# EAGLE design BpodMainBoard_r1_0 (EAGLE 8.4.3)
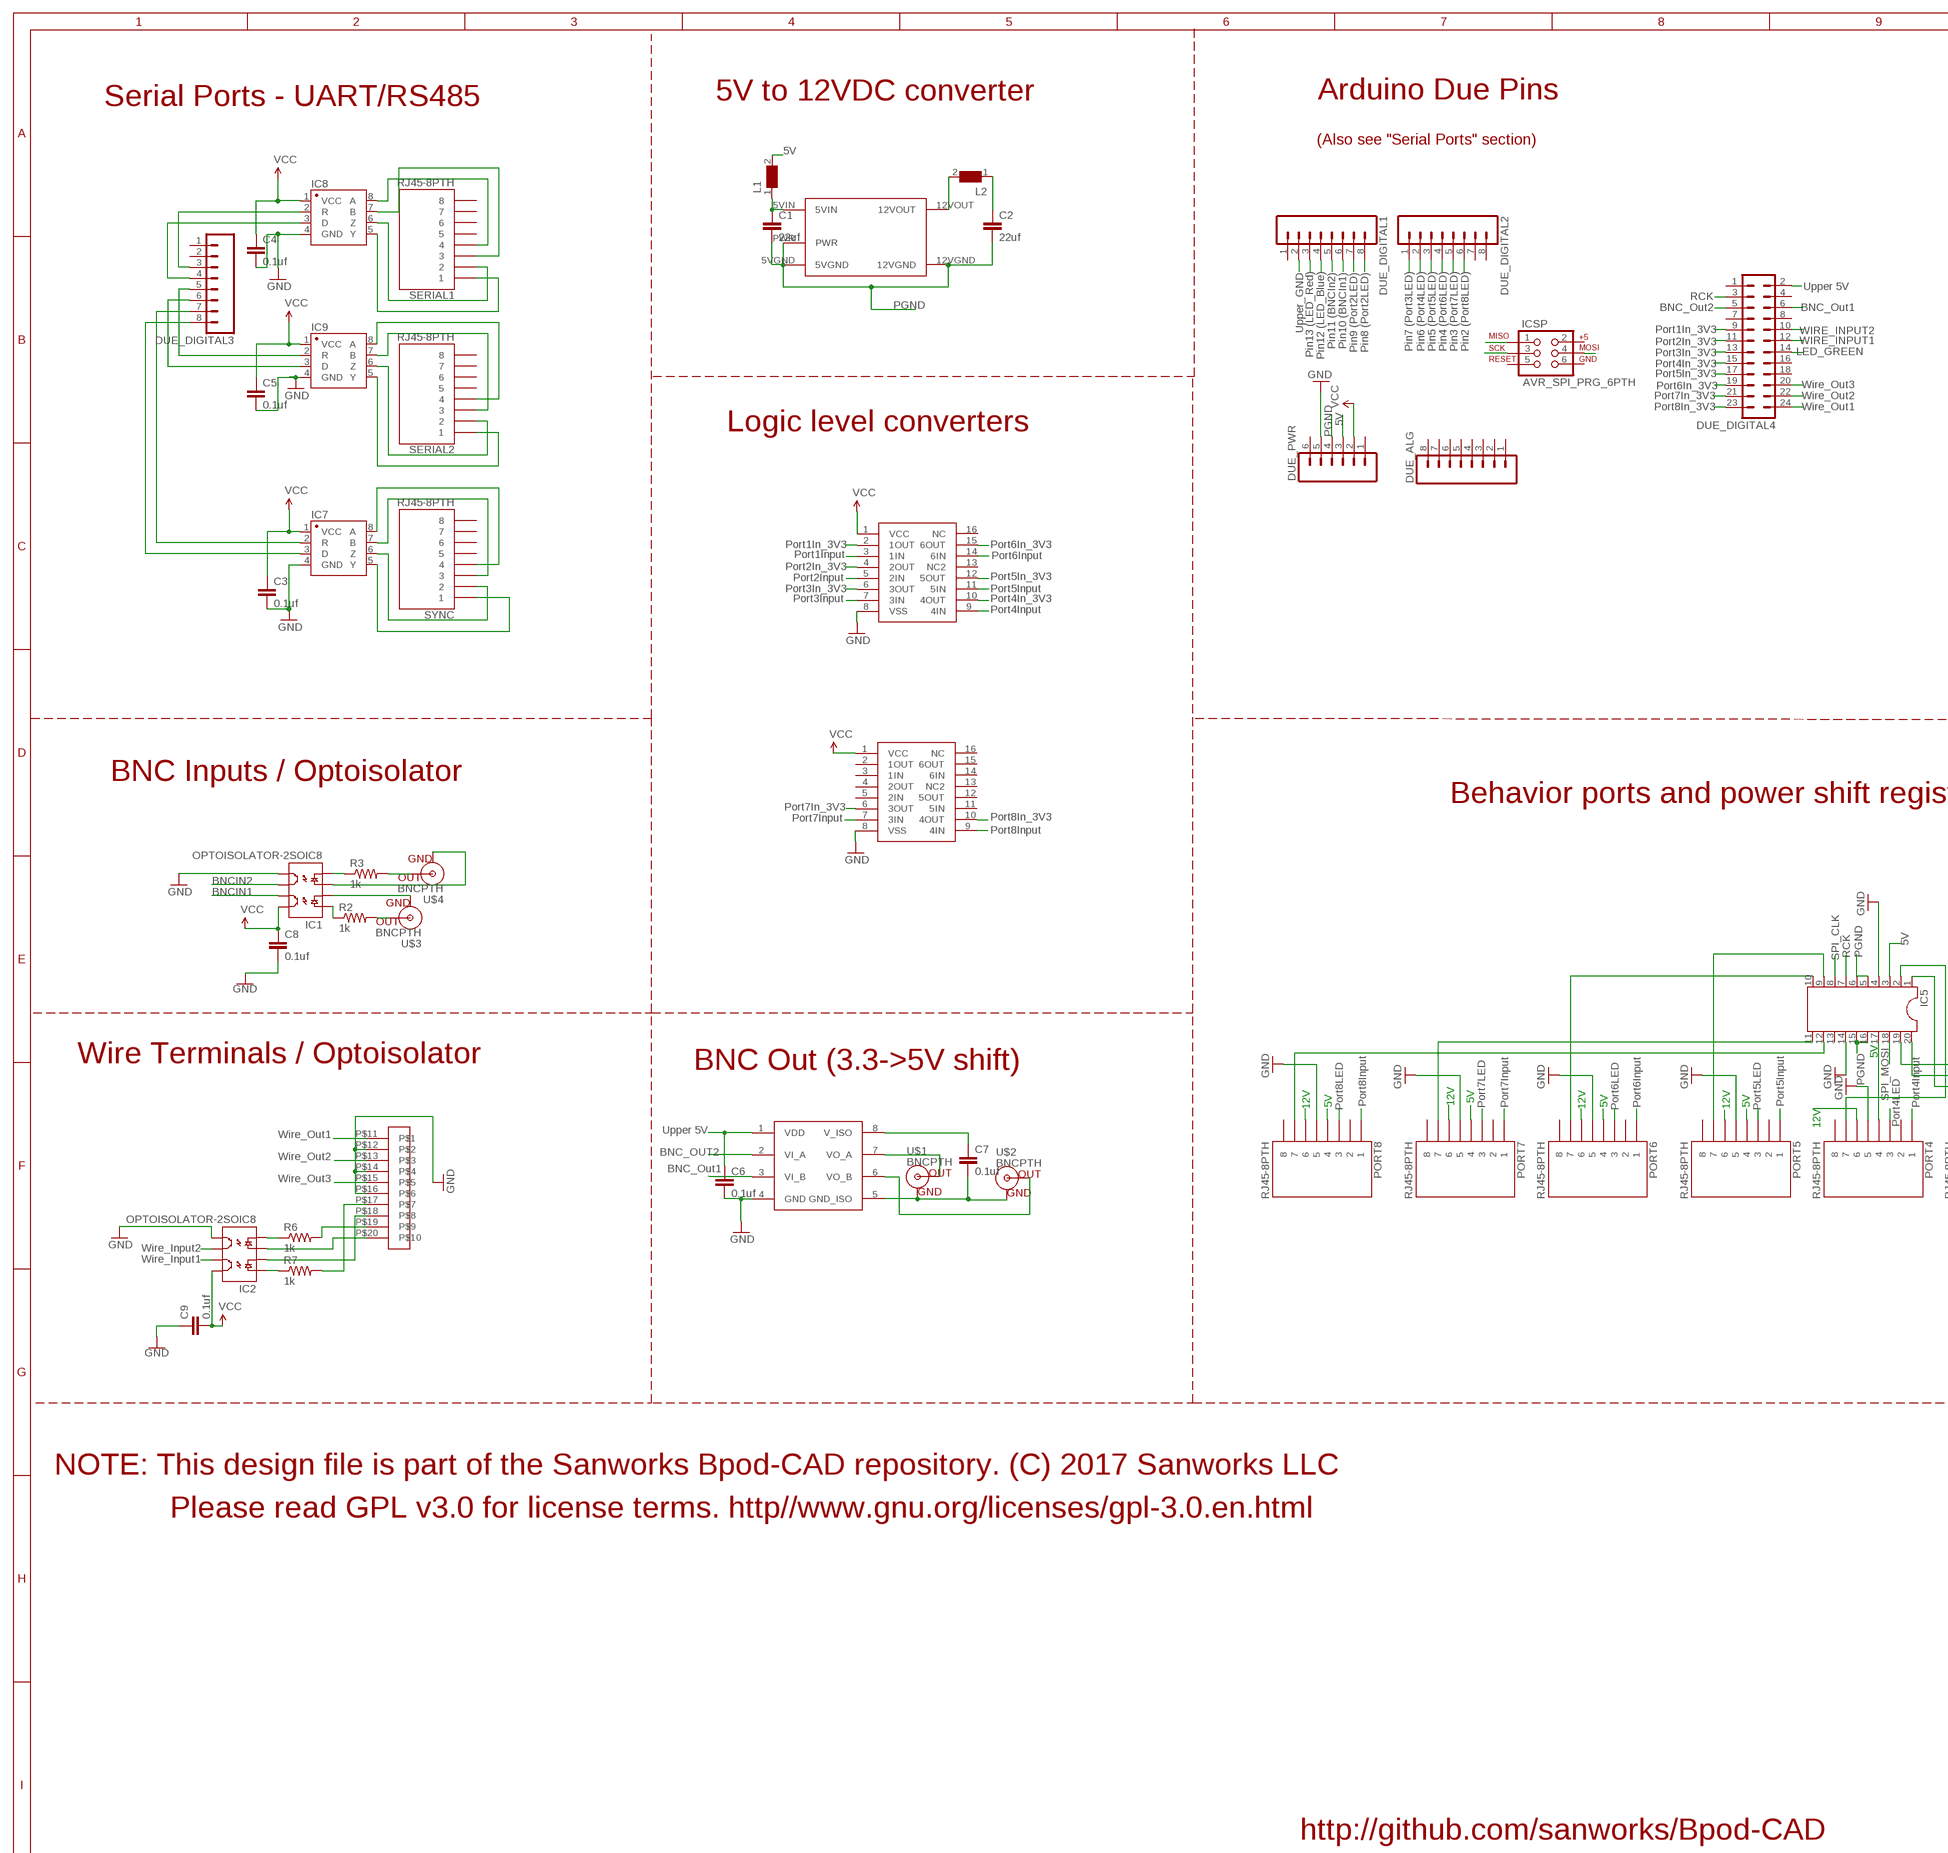
[diagram p0: schematic, sheet 1, part 1 of 2]
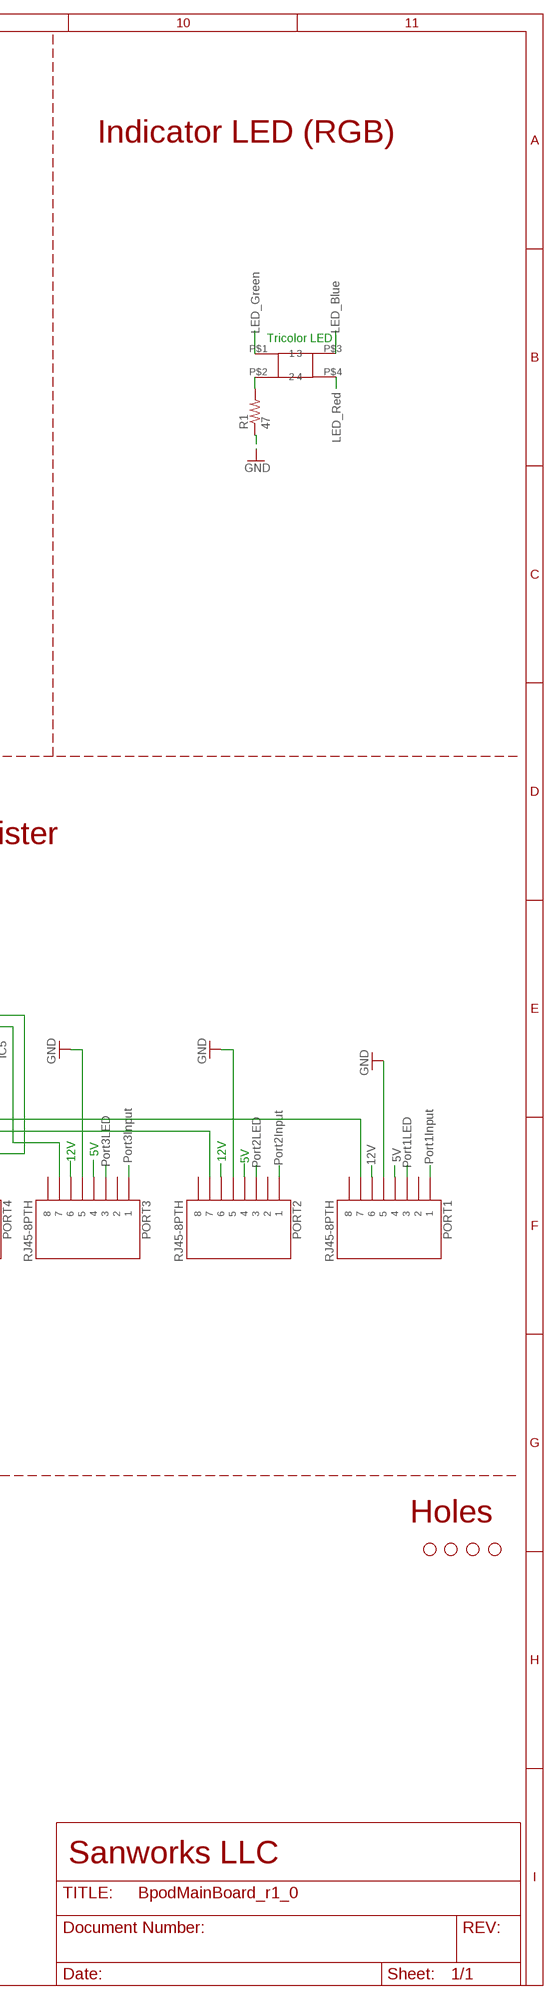
[diagram p1: schematic, sheet 1, part 2 of 2]

## Parts
C1  22uf  CAP1206  [1206]
C2  22uf  CAP1206  [1206]
C3  0.1uf  CAP1206  [1206]
C4  0.1uf  CAP1206  [1206]
C5  0.1uf  CAP1206  [1206]
C6  0.1uf  CAP1206  [1206]
C7  0.1uf  CAP1206  [1206]
C8  0.1uf  CAP1206  [1206]
C9  0.1uf  CAP1206  [1206]
DUE_ALG  M081X08  [1X08]
DUE_DIGITAL1  M081X08  [1X08]
DUE_DIGITAL2  M081X08  [1X08]
DUE_DIGITAL3  M081X08  [1X08]
DUE_DIGITAL4  MA12-2  [MA12-2]
DUE_PWR  M06SIP  [1X06]
IC1  OPTOISOLATOR-2SOIC8  [SO08-2]
IC2  OPTOISOLATOR-2SOIC8  [SO08-2]
IC3  CD4050  [SO16]
IC4  CD4050  [SO16]
IC5  DIL20  [DIL20]
IC7  SN65HVD31DR  [SO08]
IC8  SN65HVD31DR  [SO08]
IC9  SN65HVD31DR  [SO08]
IC10  ADUM5240  [SO08]
ICSP  AVR_SPI_PRG_6PTH  [2X3]
JP1  STAND-OFF  [STAND-OFF]
JP2  STAND-OFF  [STAND-OFF]
JP3  STAND-OFF  [STAND-OFF]
JP4  STAND-OFF  [STAND-OFF]
L1  WE-CBF-742792118_1206  [1206]
L2  WE-CBF-742792118_1206  [1206]
PORT1  RJ45-8PTH  [RJ45-8]
PORT2  RJ45-8PTH  [RJ45-8]
PORT3  RJ45-8PTH  [RJ45-8]
PORT4  RJ45-8PTH  [RJ45-8]
PORT5  RJ45-8PTH  [RJ45-8]
PORT6  RJ45-8PTH  [RJ45-8]
PORT7  RJ45-8PTH  [RJ45-8]
PORT8  RJ45-8PTH  [RJ45-8]
R1  47  RESISTOR1206  [1206]
R2  1k  RESISTOR1206  [1206]
R3  1k  RESISTOR1206  [1206]
R6  1k  RESISTOR1206  [1206]
R7  1k  RESISTOR1206  [1206]
SERIAL1  RJ45-8PTH  [RJ45-8]
SERIAL2  RJ45-8PTH  [RJ45-8]
SYNC  RJ45-8PTH  [RJ45-8]
U$1  BNCPTH  [BNC]
U$2  BNCPTH  [BNC]
U$3  BNCPTH  [BNC]
U$4  BNCPTH  [BNC]
U$5  TDK_LAMBDA_5V_TO_12V  [TDK_LAMBDA_5V_12V]
U$6  10POS_SPRING_TERMINAL  [10POS_SCREW_TERMINAL]
U$8  SQUARE_TRICOLOR_LED  [SQUARE_TRICOLOR_LED]

## Nets
5V: DUE_PWR.3 IC5.3 IC5.17 L1.2 PORT1.4 PORT2.4 PORT3.4 PORT4.4 PORT5.4 PORT6.4 PORT7.4 PORT8.4
12V: C2.1 L2.1 PORT1.6 PORT2.6 PORT3.6 PORT4.6 PORT5.6 PORT6.6 PORT7.6 PORT8.6
BNC_OUT1: DUE_DIGITAL4.6 IC10.3(VI_B)
BNC_OUT2: DUE_DIGITAL4.5 IC10.2(VI_A)
BNCIN1: DUE_DIGITAL1.6 IC1.7(EM1)
BNCIN2: DUE_DIGITAL1.5 IC1.6(CL2)
GND: C3.2 C4.2 C5.2 C6.2 C8.2 C9.1 DUE_PWR.5 IC1.5(EM2) IC2.5(EM2) IC3.8(VSS) IC4.8(VSS) IC5.4 IC5.14 IC7.4(GND) IC8.4(GND) IC9.4(GND) IC10.4(GND) PORT1.5 PORT2.5 PORT3.5 PORT4.5 PORT5.5 PORT6.5 PORT7.5 PORT8.5 R1.1 U$6.P$12 U$6.P$14 U$6.P$16
ISOGND: C7.2 IC10.5(GND_ISO) U$1.GND U$2.GND
LED_BLUE: DUE_DIGITAL1.4 U$8.P$3
LED_GREEN: DUE_DIGITAL4.14 U$8.P$1
LED_RED: DUE_DIGITAL1.3 U$8.P$4
MOSI: IC5.18 ICSP.4
N$1: R3.2 U$4.S(OUT)
N$2: R2.2 U$3.S(OUT)
N$3: IC1.3(A2) U$4.GND
N$4: IC1.2(C1) U$3.GND
N$5: R6.2 U$6.P$19
N$6: IC10.6(VO_B) U$2.S(OUT)
N$8: IC10.7(VO_A) U$1.S(OUT)
N$9: IC5.19 PORT1.7
N$10: IC5.20 PORT2.7
N$11: IC5.1 PORT3.7
N$12: IC5.2 PORT4.7
N$13: IC5.9 PORT5.7
N$14: IC5.10 PORT6.7
N$15: IC5.11 PORT7.7
N$16: IC5.12 PORT8.7
N$17: IC7.8(A) SYNC.4
N$18: IC7.7(B) SYNC.3
N$19: IC7.6(Z) SYNC.2
N$21: IC7.5(Y) SYNC.1
N$22: DUE_DIGITAL3.7 IC7.2(R)
N$23: IC2.4(C2) R6.1
N$24: IC2.1(A1) R7.1
N$25: R1.2 U$8.P$2
N$26: C7.1 IC10.8(V_ISO)
N$28: DUE_DIGITAL3.8 IC7.3(D)
N$32: IC8.8(A) SERIAL1.4
N$33: IC8.7(B) SERIAL1.3
N$34: IC8.6(Z) SERIAL1.2
N$35: IC8.5(Y) SERIAL1.1
N$36: IC9.8(A) SERIAL2.4
N$37: IC9.7(B) SERIAL2.3
N$38: IC9.6(Z) SERIAL2.2
N$40: IC9.5(Y) SERIAL2.1
N$42: DUE_DIGITAL3.3 IC8.2(R)
N$43: IC2.3(A2) U$6.P$20
N$44: R7.2 U$6.P$17
N$45: IC2.2(C1) U$6.P$18
N$46: C1.1 L1.1 U$5.5VIN
N$47: L2.2 U$5.12VOUT
N$48: DUE_DIGITAL3.4 IC8.3(D)
N$52: DUE_DIGITAL3.5 IC9.2(R)
N$53: DUE_DIGITAL3.6 IC9.3(D)
N$54: IC1.1(A1) R2.1
N$55: IC1.4(C2) R3.1
PGND: C1.2 C2.2 DUE_PWR.4 IC5.5 IC5.6 IC5.15 IC5.16 U$5.5VGND U$5.12VGND U$5.PWR
PORT1IN_3V3: DUE_DIGITAL4.9 IC3.2(1OUT)
PORT1INPUT: IC3.3(1IN) PORT1.1
PORT1LED: DUE_DIGITAL1.7 PORT1.3
PORT2IN_3V3: DUE_DIGITAL4.11 IC3.4(2OUT)
PORT2INPUT: IC3.5(2IN) PORT2.1
PORT2LED: DUE_DIGITAL1.8 PORT2.3
PORT3IN_3V3: DUE_DIGITAL4.13 IC3.6(3OUT)
PORT3INPUT: IC3.7(3IN) PORT3.1
PORT3LED: DUE_DIGITAL2.1 PORT3.3
PORT4IN_3V3: DUE_DIGITAL4.15 IC3.10(4OUT)
PORT4INPUT: IC3.9(4IN) PORT4.1
PORT4LED: DUE_DIGITAL2.2 PORT4.3
PORT5IN_3V3: DUE_DIGITAL4.17 IC3.12(5OUT)
PORT5INPUT: IC3.11(5IN) PORT5.1
PORT5LED: DUE_DIGITAL2.3 PORT5.3
PORT6IN_3V3: DUE_DIGITAL4.19 IC3.15(6OUT)
PORT6INPUT: IC3.14(6IN) PORT6.1
PORT6LED: DUE_DIGITAL2.4 PORT6.3
PORT7IN_3V3: DUE_DIGITAL4.21 IC4.6(3OUT)
PORT7INPUT: IC4.7(3IN) PORT7.1
PORT7LED: DUE_DIGITAL2.5 PORT7.3
PORT8IN_3V3: DUE_DIGITAL4.23 IC4.10(4OUT)
PORT8INPUT: IC4.9(4IN) PORT8.1
PORT8LED: DUE_DIGITAL2.6 PORT8.3
RCK: DUE_DIGITAL4.3 IC5.7
SPI_CLK: IC5.8 ICSP.3
SPI_MISO: ICSP.1
UPPER_5V: C6.1 DUE_DIGITAL4.2 IC10.1(VDD)
UPPER_GND: DUE_DIGITAL1.2
VCC: C3.1 C4.1 C5.1 C8.1 C9.2 DUE_PWR.2 IC1.8(CL1) IC2.8(CL1) IC3.1(VCC) IC4.1(VCC) IC7.1(VCC) IC8.1(VCC) IC9.1(VCC)
WIRE_INPUT1: DUE_DIGITAL4.12 IC2.7(EM1)
WIRE_INPUT2: DUE_DIGITAL4.10 IC2.6(CL2)
WIRE_OUT1: DUE_DIGITAL4.24 U$6.P$11
WIRE_OUT2: DUE_DIGITAL4.22 U$6.P$13
WIREOUT3: DUE_DIGITAL4.20 U$6.P$15
Unconnected: DUE_ALG.1 DUE_ALG.2 DUE_ALG.3 DUE_ALG.4 DUE_ALG.5 DUE_ALG.6 DUE_ALG.7 DUE_ALG.8 DUE_DIGITAL1.1 DUE_DIGITAL2.7 DUE_DIGITAL2.8 DUE_DIGITAL3.1 DUE_DIGITAL3.2 DUE_DIGITAL4.1 DUE_DIGITAL4.4 DUE_DIGITAL4.7 DUE_DIGITAL4.8 DUE_DIGITAL4.16 DUE_DIGITAL4.18 DUE_PWR.1 DUE_PWR.6 IC3.13(NC2) IC3.16(NC) IC4.2(1OUT) IC4.3(1IN) IC4.4(2OUT) IC4.5(2IN) IC4.11(5IN) IC4.12(5OUT) IC4.13(NC2) IC4.14(6IN) IC4.15(6OUT) IC4.16(NC) IC5.13 ICSP.2 ICSP.5 ICSP.6 PORT1.2 PORT1.8 PORT2.2 PORT2.8 PORT3.2 PORT3.8 PORT4.2 PORT4.8 PORT5.2 PORT5.8 PORT6.2 PORT6.8 PORT7.2 PORT7.8 PORT8.2 PORT8.8 SERIAL1.5 SERIAL1.6 SERIAL1.7 SERIAL1.8 SERIAL2.5 SERIAL2.6 SERIAL2.7 SERIAL2.8 SYNC.5 SYNC.6 SYNC.7 SYNC.8

## Notes on the sheet
- Serial Ports - UART/RS485 | 5V to 12VDC converter | Arduino Due Pins
- Indicator LED (RGB)
- (Also see "Serial Ports" section)
- 5V
- LED_Green
- LED_Blue
- Upper_GND | Pin13 (LED_Red) | Pin12 (LED_Blue) | Pin11 (BNCIn2) | Pin10 (BNCIn1) | Pin9 (Port2LED) | Pin8 (Port2LED) | Pin7 (Port3LED) | Pin6 (Port4LED) | Pin5 (Port5LED) | Pin4 (Port6LED) | Pin3 (Port7LED) | Pin2 (Port8LED)
- Upper 5V
- RCK
- BNC_Out2 | BNC_Out1
- PGND
- WIRE_INPUT2 | Tricolor LED
- Port1In_3V3
- WIRE_INPUT1
- Port2In_3V3 | LED_GREEN
- Port3In_3V3
- Port4In_3V3
- LED_Red
- Port5In_3V3
- Wire_Out3
- Port6In_3V3 | Wire_Out2
- Port7In_3V3
- Wire_Out1
- Port8In_3V3
- 5V
- Logic level converters
- PGND
- Port1In_3V3 | Port6In_3V3
- Port1Input | Port6Input
- Port2In_3V3
- Port2Input | Port5In_3V3
- Port3In_3V3 | Port5Input
- Port3Input | Port4In_3V3
- Port4Input
- BNC Inputs / Optoisolator
- Behavior ports and power shift register
- Port7In_3V3
- Port7Input | Port8In_3V3
- Port8Input
- BNCIN2
- BNCIN1
- SPI_CLK
- PGND
- RCK | 5V
- 5V
- SPI_MOSI
- Port8Input | Port5Input | PGND | Port3Input | Port2Input | Port1Input
- Port7Input | Port6Input | Port4Input
- Port8LED | Port7LED | Port6LED | Port5LED | Port3LED | Port2LED | Port1LED
- Wire Terminals / Optoisolator | BNC Out (3.3->5V shift)
- Port4LED
- 12V | 12V | 5V | 12V
- 12V | 5V | 12V | 12V | 12V
- 5V | 5V | 5V | 5V | 5V
- 12V
- Upper 5V
- Wire_Out1
- BNC_OUT2
- Wire_Out2
- BNC_Out1
- Wire_Out3
- Wire_Input2
- Wire_Input1
- Holes
- NOTE: This design file is part of the Sanworks Bpod-CAD repository. (C) 2017 Sanworks LLC
- Please read GPL v3.0 for license terms. http//www.gnu.org/licenses/gpl-3.0.en.html
- Sanworks LLC
- http://github.com/sanworks/Bpod-CAD

## Library data of the parts
C1-C9 = SparkFun-Capacitors:CAP: Capacitor Standard 0603 ceramic capacitor, and 0.1" leaded capacitor.
DUE_ALG DUE_DIGITAL1-DUE_DIGITAL3 = SparkFun:M08: Header 8 Standard 8-pin 0.1" header. Use with straight break away headers (SKU : PRT-00116), right angle break away headers (PRT-00553), swiss pins (PRT-00743), machine pins (PRT-00117), and female headers (PRT-00115).
DUE_DIGITAL4 = con-lstb:MA12-2: PIN HEADER; OC_FARNELL: unknown; OC_NEWARK: unknown
DUE_PWR = SparkFun:M06: Header 6 Standard 6-pin 0.1" header. Use with straight break away headers (SKU : PRT-00116), right angle break away headers (PRT-00553), swiss pins (PRT-00743), machine pins (PRT-00117), and female headers (PRT-00115). Molex polarized connector foot print use with SKU : PRT-08094 with associated crimp pins and housings. NOTES ON THE VARIANTS LOCK and LOCK_LONGPADS... This footprint was designed to help hold the alignment of a through-hole component (i.e. 6-pin header) while soldering it into place. You may notice that each hole has been shifted either up or down by 0.005 of an inch from it's more standard position (which is a perfectly straight line). This slight alteration caused the pins (the squares in the middle) to touch the edges of the holes. Because they are alternating, it causes a "brace" to hold the component in place. 0.005 has proven to be the perfect amount of "off-center" position when using our standard breakaway headers. Although looks a little odd when you look at the bare footprint, once you have a header in there, the alteration is very hard to notice. Also, if you push a header all the way into place, it is covered up entirely on the bottom side. This idea of altering the position of holes to aid alignment will be further integrated into the Sparkfun Library for other footprints. It can help hold any component with 3 or more connection pins.
IC1 IC2 = SparkFun-DiscreteSemi:OPTOISOLATOR-2: Description: Dual gate opto isolator. Vishay part : ILD213T; PROD_ID: IC-09076
IC3 IC4 = SparkFun-DigitalIC:CD4050
IC5 = ic-package:DIL20: Dual In Line / Socket
IC7-IC9 = Joshparts4:SN65HVD31DR: A placeholder for generic narrow & wide SOIC8 foorptints - used on the DIP adapter board.
IC10 = SparkFun-DigitalIC:ADUM5240
ICSP = SparkFun:AVR_SPI_PRG_6: AVR ISP 6 Pin This is the reduced ISP connector for AVR programming. Common on Arduino. This footprint will take up less PCB space and can be used with a 10-pin to 6-pin adapter such as SKU: BOB-08508
JP1-JP4 = SparkFun:STAND-OFF: Stand Off This is the mechanical footprint for a #4 phillips button head screw. Use the keepout ring to avoid running the screw head into surrounding components. SKU : PRT-00447
L1 L2 = WE-CBF:WE-CBF: SMD EMI Suppression Ferrite Beads WE-CBF - Excellent anti-EMI properties - Low DC-restistance - Impedances till 3000 ohms - Rated current up to 6 A -- Reliable Ni-Sn electrodes -- Perfect as data lined filter and for uncoupling of distribution voltage; MPN: 742792118; OC_FARNELL: 1800374; OC_NEWARK: 78R5648; PACKAGE: IND-1206; SUPPLIER: Wuerth Elektronik
PORT1-PORT8 SERIAL1 SERIAL2 SYNC = SparkFun:RJ45-8: RJ45 Jack Simple RJ45, 8-pin connection - connector for common Cat5, Cat5e, and Cat6 Ethernet cables. Footprint not yet proven in production. Connector sku is PRT-00643; Breakout PCB sku is BOB-00716.
R1 = SparkFun-Passives:RESISTOR: Resistor Basic schematic elements and footprints for 0603, 1206, and PTH resistors.
R2 R3 R6 R7 = SparkFun-Resistors:RESISTOR: Resistor Basic schematic elements and footprints for 0603, 1206, and PTH resistors.
U$1 U$2 = SparkFun-Connectors:BNC: BNC Connector, Mouser Part# 5227161
U$3 U$4 = SparkFun:BNC: BNC Connector, Mouser Part# 5227161
U$5 = JoshParts:TDK_LAMBDA_5V_TO_12V
U$6 = JoshParts:10POS_SPRING_TERMINAL
U$8 = JoshParts:SQUARE_TRICOLOR_LED

## Net classes
0 default: width 0.254 mm, clearance 0.254 mm

## Board
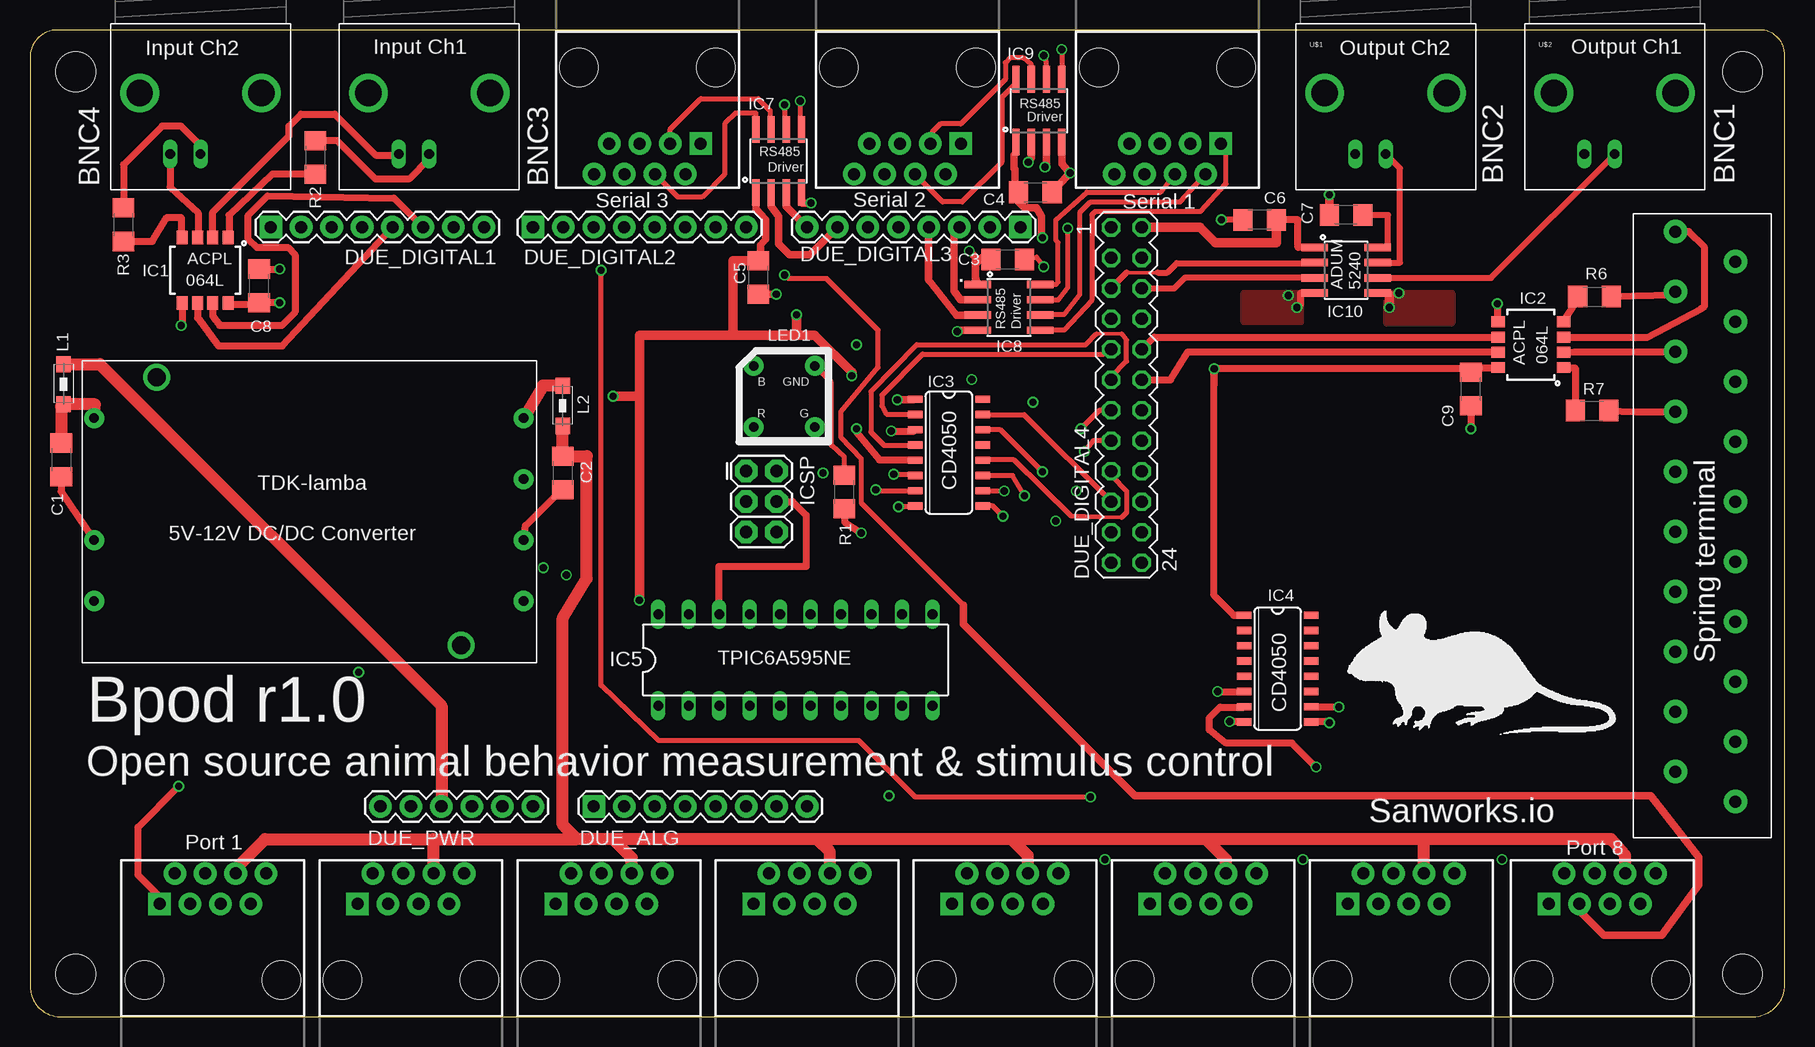
[diagram p2: board, top side]
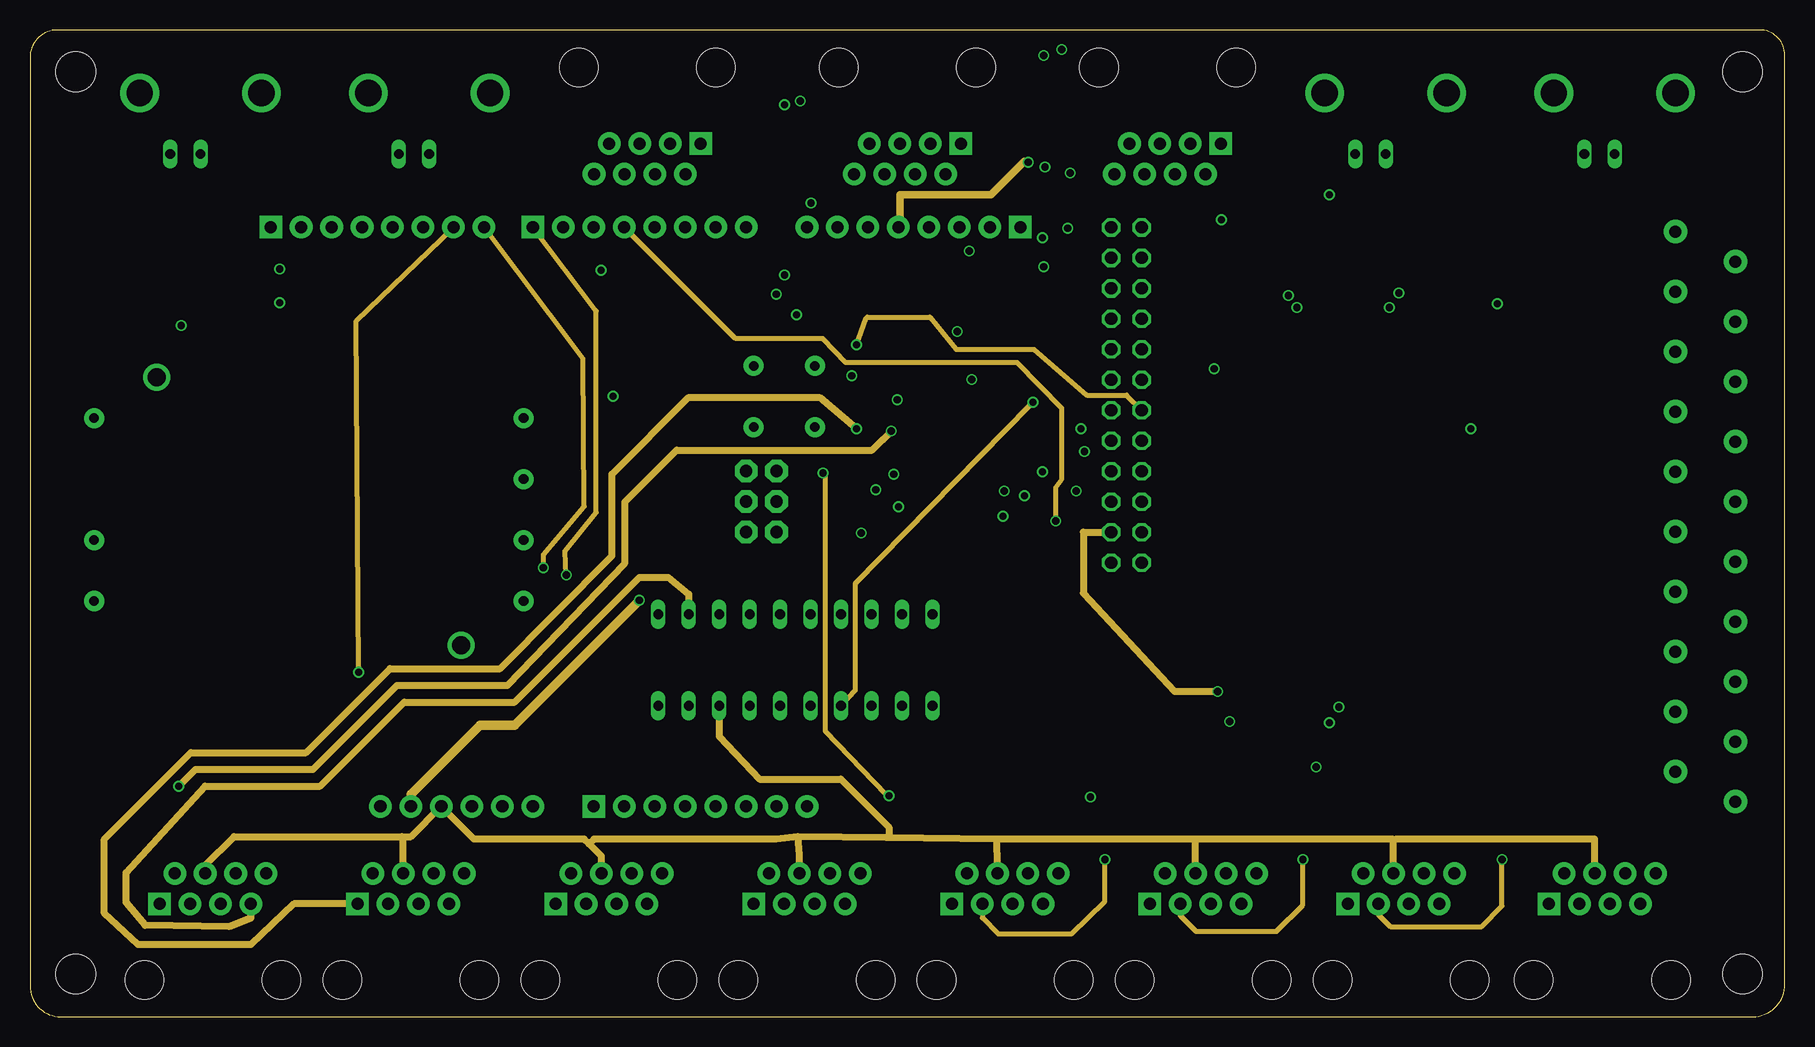
[diagram p3: board, inner layer Route2]
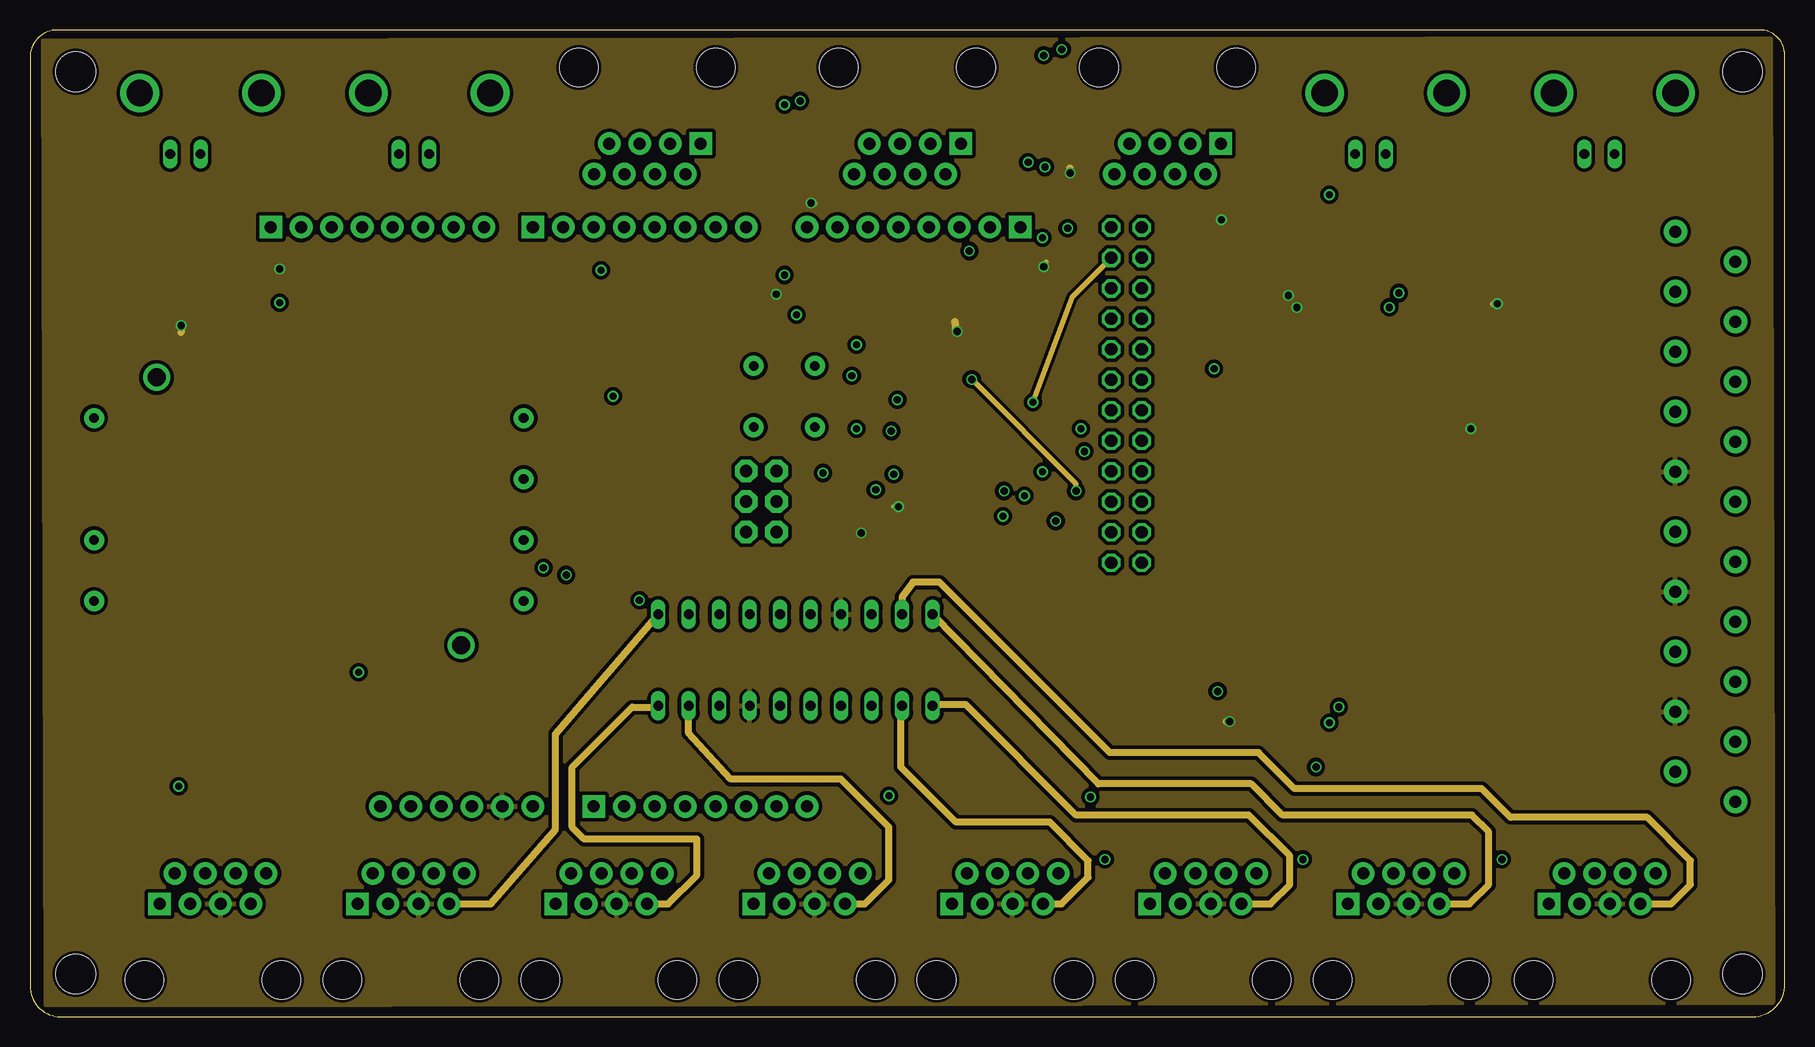
[diagram p4: board, inner layer Route15]
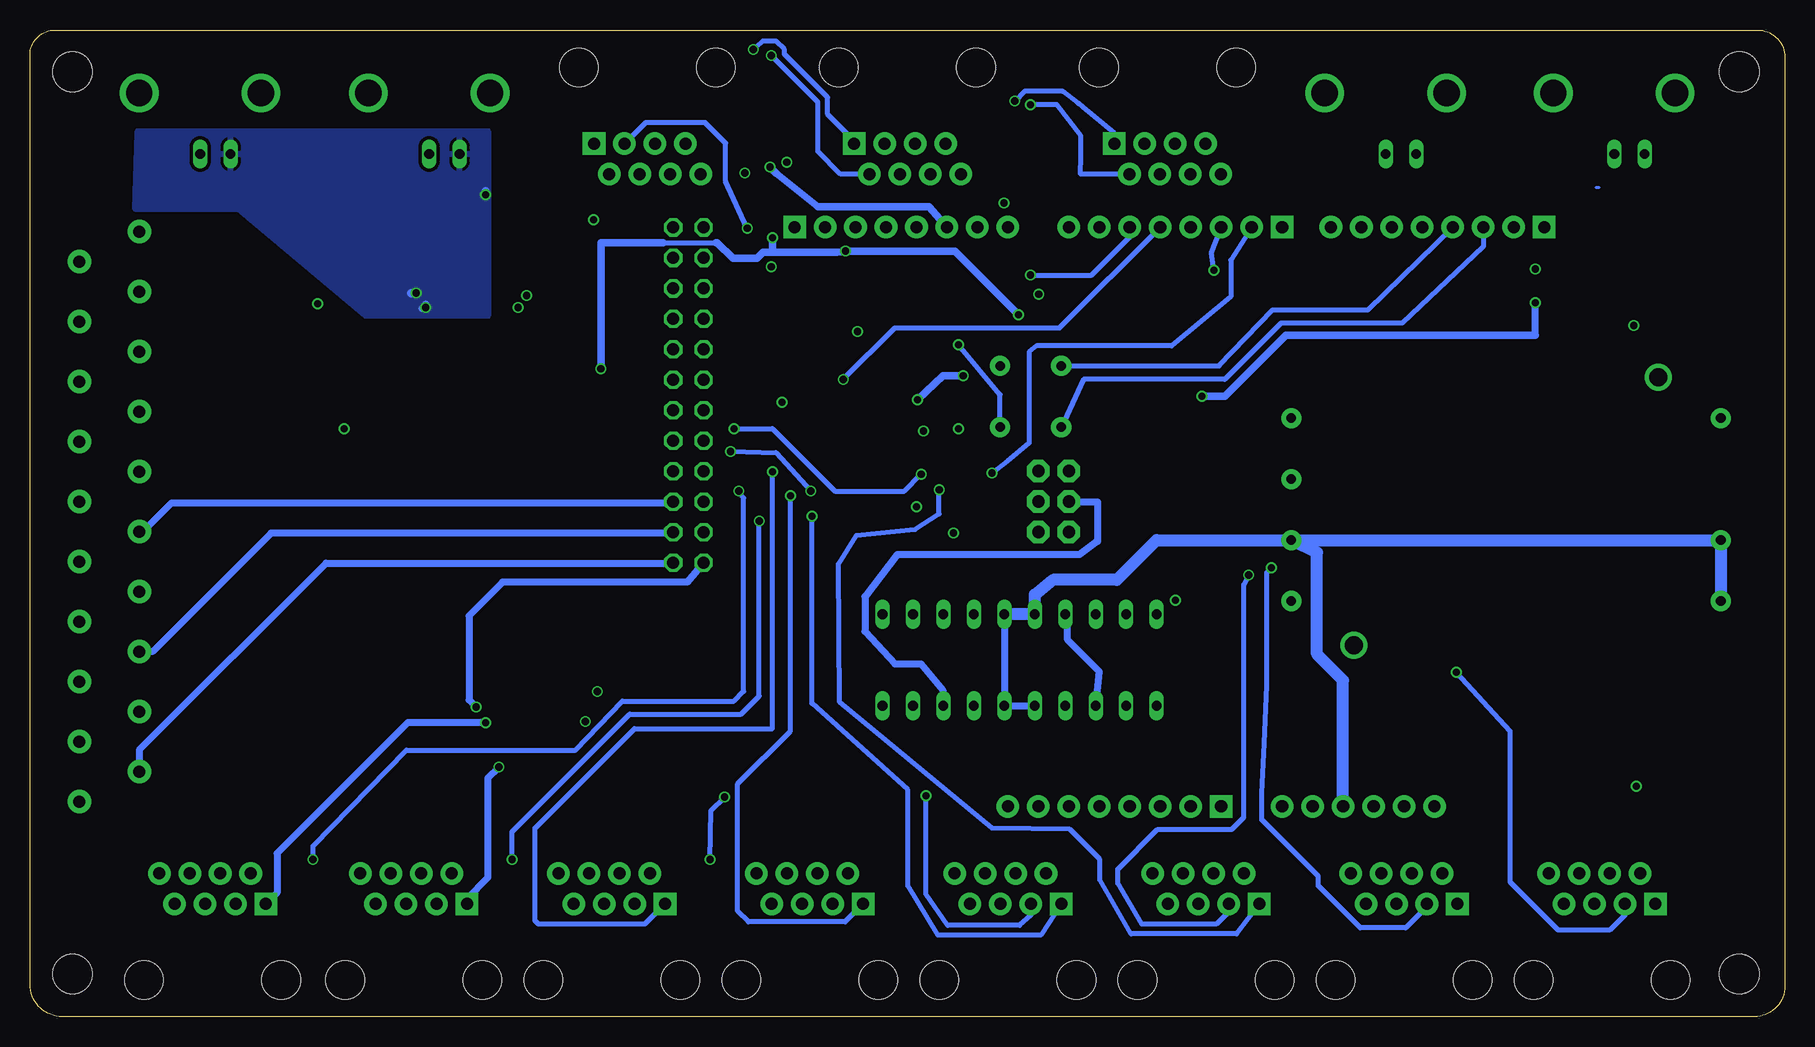
[diagram p5: board, bottom side, seen from below]

Size 146.28 x 82.22 mm. Coordinates in mm from the lower left corner, seen from the top.
Outline: 143.6,0 arc90 146.28,2.69 146.28,80.13 arc90 144.2,82.22 2.28,82.22 arc90 0,79.94 0,2.54 arc90 2.54,0 143.6,0
Copper layers (1*2*15*16): Top 0.035mm / dielectric 0.2mm / Route2 0.0175mm / dielectric 0.3mm / Route15 0.0175mm / dielectric 0.2mm / Bottom 0.035mm
Design rules "SeeedStudio_4layer_DRU_no_angle_20140221 *": minimum track width 8mil, minimum drill 12mil, track to track 12mil, track to pad 12mil, pad to pad 12mil, via to via 12mil, smd to smd 0mil, copper to edge 10mil, drill to drill 8mil, minimum pad ring 6mil, minimum via ring 4mil, stop-mask expansion 4mil, vias tented up to drill 25mil, thermal gap 10mil

### Footprints (pad centres in the part's own frame; a part is rotated, then mirrored left to right if it is on the bottom)
1206 = smd 1.6 x 1.8: 1 -1.4,0; 2 1.4,0
1X08 = drill 1.016 pad 1.88 square: 1 0,0 | drill 1.016 pad 1.88: 2 2.54,0; 3 5.08,0; 4 7.62,0; 5 10.16,0; 6 12.7,0; 7 15.24,0; 8 17.78,0
MA12-2 = drill 1.016 octagon: 1 -13.97,-1.27; 2 -13.97,1.27; 3 -11.43,-1.27; 4 -11.43,1.27; 5 -8.89,-1.27; 6 -8.89,1.27; 7 -6.35,-1.27; 8 -6.35,1.27; 9 -3.81,-1.27; 10 -3.81,1.27; 11 -1.27,-1.27; 12 -1.27,1.27; 13 1.27,-1.27; 14 1.27,1.27; 15 3.81,-1.27; 16 3.81,1.27; 17 6.35,-1.27; 18 6.35,1.27; 19 8.89,-1.27; 20 8.89,1.27; 21 11.43,-1.27; 22 11.43,1.27; 23 13.97,-1.27; 24 13.97,1.27
1X06 = drill 1.016 pad 1.88: 1 0,0; 2 2.54,0; 3 5.08,0; 4 7.62,0; 5 10.16,0; 6 12.7,0
SO08-2 = smd 0.914 x 1.143: 1 -1.905,-2.731; 2 -0.635,-2.731; 3 0.635,-2.731; 4 1.905,-2.731; 5 1.905,2.731; 6 0.635,2.731; 7 -0.635,2.731; 8 -1.905,2.731
SO16 = smd 0.6 x 1.2: 1 -4.445,-2.8; 2 -3.175,-2.8; 3 -1.905,-2.8; 4 -0.635,-2.8; 5 0.635,-2.8; 6 1.905,-2.8; 7 3.175,-2.8; 8 4.445,-2.8; 9 4.445,2.8; 10 3.175,2.8; 11 1.905,2.8; 12 0.635,2.8; 13 -0.635,2.8; 14 -1.905,2.8; 15 -3.175,2.8; 16 -4.445,2.8
DIL20 = drill 0.813 long: 1 -11.43,-3.81; 2 -8.89,-3.81; 3 -6.35,-3.81; 4 -3.81,-3.81; 5 -1.27,-3.81; 6 1.27,-3.81; 7 3.81,-3.81; 8 6.35,-3.81; 9 8.89,-3.81; 10 11.43,-3.81; 11 11.43,3.81; 12 8.89,3.81; 13 6.35,3.81; 14 3.81,3.81; 15 1.27,3.81; 16 -1.27,3.81; 17 -3.81,3.81; 18 -6.35,3.81; 19 -8.89,3.81; 20 -11.43,3.81
SO08 = smd 0.61 x 2.21: 1 -1.905,-2.616; 2 -0.635,-2.616; 3 0.635,-2.616; 4 1.905,-2.616; 5 1.905,2.616; 6 0.635,2.616; 7 -0.635,2.616; 8 -1.905,2.616
2X3 = drill 1.016 pad 1.88 octagon: 1 0,0; 2 0,2.54; 3 2.54,0; 4 2.54,2.54; 5 5.08,0; 6 5.08,2.54
STAND-OFF = hole 3.302: 0,0
1206' = smd 1.35 x 1.2: 1 -1.675,0; 2 1.675,0
RJ45-8 = drill 1 pad 1.88 square: 1 -4.445,6.35 | drill 1 pad 1.88: 2 -3.175,8.89; 3 -1.905,6.35; 4 -0.635,8.89; 5 0.635,6.35; 6 1.905,8.89; 7 3.175,6.35; 8 4.445,8.89 | hole 3.2: -5.715,0; 5.715,0
BNC = drill 2.2: 3 -5.08,5.08; 4 5.08,5.08 | drill 0.8 long: GND -2.54,0; S 0,0
TDK_LAMBDA_5V_12V = drill 0.8 pad 1.676: 5VGND -6,-12.24; 5VIN -6,3; 12VGND 29.8,-7.16; 12VOUT 29.8,3; P$4 29.8,-12.24; P$6 29.8,-2.08; PWR -6,-7.16 | drill 1.5: P$8 -0.8,6.4; P$9 24.6,-15.92
10POS_SCREW_TERMINAL = drill 1 pad 1.93: P$1 -10,-5; P$2 -5,-5; P$3 0,-5; P$4 5,-5; P$5 10,-5; P$6 -15,-5; P$7 15,-5; P$8 -20,-5; P$9 20,-5; P$10 -25,-5; P$11 -22.5,0; P$12 -17.5,0; P$13 -12.5,0; P$14 -7.5,0; P$15 -2.5,0; P$16 2.5,0; P$17 7.5,0; P$18 12.5,0; P$19 17.5,0; P$20 22.5,0
SQUARE_TRICOLOR_LED = drill 0.8 pad 1.676: P$1 -5.1,5.1; P$2 -5.1,0; P$3 0,0; P$4 0,5.1

### Placement (x,y rotation side)
C1  2.6,46.4 270 top
C2  44.4,45.3 270 top
C3  81.5,63.1 0 top
C4  83.8,68.7 0 top
C5  60.7,61.6 270 top
C6  102.5,66.4 180 top
C7  109.7,66.8 180 top
C8  19.1,60.9 90 top
C9  120.1,52.3 90 top
DUE_ALG  46.99,17.53 0 top
DUE_DIGITAL1  20.07,65.79 0 top
DUE_DIGITAL2  41.91,65.79 0 top
DUE_DIGITAL3  82.55,65.79 180 top
DUE_DIGITAL4  91.4,51.8 270 top
DUE_PWR  29.21,17.53 0 top
IC1  14.6,62.2 180 top
IC2  125.1,56 90 top
IC3  76.6,47 270 top
IC4  104,29 270 top
IC5  63.8,29.72 0 top
IC7  62.4,71.3 0 top
IC8  81.6,59.1 270 top
IC9  84.1,75.5 0 top
IC10  109.7,62.2 270 top
ICSP  59.69,45.47 270 top
JP1  3.81,78.74 0 top
JP2  3.81,3.56 0 top
JP3  142.75,3.56 0 top
JP4  142.75,78.74 0 top
L1  [1206']  2.8,52.7 90 top
L2  [1206']  44.4,50.9 90 top
PORT1  15.24,3.05 0 top
PORT2  31.75,3.05 0 top
PORT3  48.26,3.05 0 top
PORT4  64.77,3.05 0 top
PORT5  81.28,3.05 0 top
PORT6  97.79,3.05 0 top
PORT7  114.3,3.05 0 top
PORT8  131.06,3.05 0 top
R1  67.88,43.73 90 top
R2  23.8,71.6 90 top
R3  7.8,66 90 top
R6  130.4,60 0 top
R7  130.2,50.5 0 top
SERIAL1  94.82,79.09 180 top
SERIAL2  73.14,79.09 180 top
SYNC  51.46,79.09 180 top
U$1  113.01,71.88 0 top
U$2  132.1,71.88 0 top
U$3  33.27,71.88 0 top
U$4  14.22,71.88 0 top
U$5  11.35,46.87 0 top
U$6  137.16,42.93 90 top
U$7  [MOUSELOGO]  107.89,35.65 270 top
U$8  60.33,54.23 180 top

### Tracks (layer width: path | path; a pad name or v marks a point on that pad's centre or on a via)
5V
  Top 1.016: L1.2 5.83,54.38 34.3,25.9 DUE_PWR.3
  Route2 0.6: PORT1.4 14.61,12.61 17,15 31,15 | 31,15 31.76,15 DUE_PWR.3 37.02,14.8 46.2,14.8 46.6,14.4 | PORT2.4 31.11,14.88 31,15 | PORT3.4 47.62,13.38 46.6,14.4 | PORT4.4 64.14,13.46 64,15 | 64,15 62.2,14.8 47,14.8 46.6,14.4 | PORT5.4 80.64,12.55 80.6,14.8 | 80.6,14.8 71.39,14.91 | 71.39,14.91 64,15 | PORT6.4 97.16,14.76 97.2,14.8 | 97.2,14.8 80.6,14.8 | PORT7.4 113.67,14.6 | 113.67,14.6 113.67,14.73 113.6,14.8 97.2,14.8 | PORT8.4 130.43,14.77 130.4,14.8 113.86,14.8 113.67,14.6 | IC5.3 57.45,23.35 60.8,19.8 67.6,19.8 71.6,15.8 71.6,15.12 71.39,14.91
  Bottom 0.6: IC5.3 57.15,28.75 59.8,31.4 59.8,33.42 IC5.17
12V
  Top 1.016: PORT3.6 50.16,13.23 48.6,14.8 | 48.6,14.8 45.6,14.8 | 45.6,14.8 44.4,16 44.4,33.2 46.4,36.5 46.4,46.7 C2.1 L2.1 | PORT1.6 17.14,12.35 19.6,14.8 33.6,14.8 | 33.6,14.8 45.6,14.8 | PORT2.6 33.66,14.74 33.6,14.8 | PORT4.6 66.67,13.72 65.6,14.8 | 65.6,14.8 48.6,14.8 | PORT5.6 83.19,13.41 81.8,14.8 | 81.8,14.8 65.6,14.8 | PORT6.6 99.69,13.11 98,14.8 | 98,14.8 81.8,14.8 | PORT7.6 116.2,14.79 115,14.8 | 115,14.8 98,14.8 | PORT8.6 132.97,13.43 131.8,14.8 115,14.8
BNC_OUT1
  Top 0.5: DUE_DIGITAL4.6 95.39,60.69 96.3,61.6 107.05,61.6 IC10.3
BNC_OUT2
  Top 0.3: 91.4,62 94,62
  Top 0.406: DUE_DIGITAL4.5 90.13,60.73
  Top 0.5: 90.13,60.73 91.4,62 | 94,62 94.8,62 95.6,62.8 107.05,62.8 IC10.2
BNCIN1
  Top 0.6: IC1.7 15.23,58.37 15.8,57.6 21,57.6 22.1,58.7 22.1,63.5 21.5,64.1 18.9,64.1 18.2,64.8 18.2,66.8 19.8,68.4 30.35,68.2 DUE_DIGITAL1.6
BNCIN2
  Top 0.6: IC1.6 13.96,58.23 15.7,55.9 21.04,55.9 DUE_DIGITAL1.5
GND  (via drill 0.6)
  Top 0.4: IC3.8 73.75,42.5 v72.4,42.5
  Top 0.406: C3.2 83.9,63.3 v84.5,62.5
  Top 0.5: C6.2 v99.3,66.4
  Top 0.6: IC1.5 12.7,57.7 v12.6,57.6 | IC4.8 100.05,24.55 v100,24.6 | IC2.5 122.36,59.4 v122.3,59.4 | R1.1 67.9,41.2 v69.3,40.3 | C8.2 v20.8,62.3 | C9.1 v120.1,49 | IC10.4 105.91,60.3 105.9,60.3 105.9,59.4 v105.6,59.1
  Top 0.61: IC8.4 77.5,57.2 v77.3,57.1 | IC7.4 64.31,67.89 64.4,67.8 v65.1,67.8 | C5.2 v62.2,60.2 | C4.2 86.5,70.1 v86.7,70.3 86,71.09 IC9.4
  Route15 0.4: v72.4,42.5 72,42.5
  Route15 0.406: v84.5,62.5 84.6,62.8 84.7,62.9
  Route15 0.6: v12.6,57.6 12.6,57 | v100,24.6 99.7,24.6 | v122.3,59.4 122,59.4 | v69.3,40.3 69.4,40.2 | v20.8,62.3 20.9,62.3 | v120.1,49 120.2,48.9
  Route15 0.61: v77.3,57.1 77.2,57.1 77.1,57.9 | v65.1,67.8 65.3,67.8 | v62.2,60.2 62.3,60.2 | v86.7,70.3 86.7,70.7
  other vias: 104.9,60.1
  pour Route15: 1.1,81.3 1.3,1 145.3,1.2 145.1,81.5
  pour Top: 105.9,60.3 105.9,57.9 101.2,57.9 101.2,60.3
ISOGND  (via drill 0.6)
  Top 0.6: IC10.5 113.3,60.3 113.3,60.1
  Top 0.7: 114,60.3 v114.1,60.3 | C7.2 v108.3,68.5
  Top 0.8: 113.3,60.1 v113.3,59.1
  Bottom 0.6: v113.3,59.1 113.3,59.4 113.6,59
  Bottom 0.7: v114.1,60.3 114.5,60.3 | v108.3,68.5 108.3,68.8
  pour Bottom: 108.1,73.8 108.1,58.4 118.3,58.4 128.9,67.3 137.5,67.3 137.3,73.7 137.3,73.8
  pour Top: 113.1,60.3 118.5,60.3 118.5,57.8 113.1,57.8
LED_BLUE
  Bottom 0.4: U$8.P$3 47.17,54.23 42.7,58.9 34.77,58.9 DUE_DIGITAL1.4
LED_GREEN  (via drill 0.6)
  Route2 0.4: v68.9,56 69.7,58.2 69.8,58.3 75,58.3 77.2,55.6 83.7,55.6 88.1,51.8 91.4,51.8 DUE_DIGITAL4.14
  Bottom 0.4: U$8.P$1 65.42,51.83 v68.9,56
LED_RED
  Bottom 0.4: DUE_DIGITAL1.3 25.15,64.15 31.9,57.8 42,57.8 46.7,53.1 58.45,53.1 U$8.P$4 60.1,48.9
MOSI
  Top 0.6: ICSP.4 63.57,42.93 64.7,41.8 64.7,37.5 57.4,37.5 57.4,33.53 IC5.18
N$1
  Top 0.6: U$4.S 14.22,72.58 12.6,74.2 11,74.2 7.8,71 R3.2
N$2
  Top 0.6: U$3.S 33.27,71.47 31.6,69.8 28.8,69.8 25.6,73 R2.2
N$3
  Top 0.6: U$4.GND 11.68,69.12 14,67 14,65.1 IC1.3
N$4
  Top 0.6: IC1.2 15.23,67.03 21.6,73.4 21.6,74.2 22.6,75.2 25.4,75.2 28.8,71.8 30.65,71.8 U$3.GND
N$5
  Top 0.6: U$6.P$19 137.09,60.1 R6.2
N$6
  Top 0.5: IC10.6 121.78,61.56 U$2.S
N$8
  Top 0.5: U$1.S 114.2,70.69 114.2,62.84 IC10.7
N$9
  Route2 0.6: PORT1.7 18.41,8.21 16.6,7.5 9.6,7.6 8,9.5 8,12 14.6,19.2 24.2,19.2 31.2,26.2 40.4,26.2 50.8,36.6 53.2,36.6 54.9,35.2 IC5.19
N$10
  Route15 0.6: PORT2.7 38.4,9.4 43.8,15.6 43.8,23.56 IC5.20
N$11
  Route15 0.6: PORT3.7 53.2,9.4 55.6,11.8 55.6,14.8 46.2,14.8 45.2,15.8 45.2,20.8 50.2,25.8 51.96,25.8 IC5.1
N$12
  Route15 0.6: PORT4.7 69.6,9.4 71.6,11.4 71.6,15.8 67.6,19.8 58.4,19.8 54.9,23.6 54.9,25.9 IC5.2
N$13
  Route15 0.6: PORT5.7 86,9.4 88.2,11.6 88.2,13 85,16.2 77.2,16.2 72.6,20.8 72.6,25.7 IC5.9
N$14
  Route15 0.6: PORT6.7 103.4,9.4 105,11 105,13.4 101.6,16.8 87.2,16.8 78,26 75.02,26 IC5.10
N$15
  Route15 0.6: PORT7.7 120,9.4 121.6,11 121.6,15.4 120.2,16.8 104.4,16.8 101.8,19.4 89.06,19.4 IC5.11
N$16
  Route15 0.6: PORT8.7 136.8,9.4 138.4,11 138.4,13 134.8,16.6 123.4,16.6 121,19 105.4,19 102.4,22 90,22 75.8,36.2 73.6,36.2 72.7,35 IC5.12
N$17
  Top 0.406: IC7.8 60.49,74.7 60.5,75.3 58.8,75.3 57.9,74.4 57.9,70.2 56,68.3 54,68.3 SYNC.4
N$18
  Top 0.406: SYNC.3 53.37,73.97 55.9,76.5 60.7,76.5 61.7,75.5 61.7,73.98 IC7.7
N$19  (via drill 0.6)
  Top 0.406: v62.9,76 62.9,74.05 IC7.6
  Bottom 0.406: v62.9,76 60.7,76 58.7,73.4 58.7,71.7 58.7,70.2 SYNC.2
N$21  (via drill 0.6)
  Top 0.406: v64.2,76.3 64.2,74.02 IC7.5
  Bottom 0.406: SYNC.1 55.91,73.61 58.5,75.8 58.9,76.1 60.2,77.1 63.4,77.1 v64.2,76.3
N$22
  Top 0.61: DUE_DIGITAL3.7 65.02,63.5 63.3,63.5 62.4,64.4 62.4,66.7 61.77,67.53 IC7.2
N$23
  Top 0.6: IC2.4 128.8,59.44 R6.1
N$24
  Top 0.6: IC2.1 128.8,54.06 R7.1
N$25
  Top 0.4: R1.2 67.88,46.62 66.8,47.6 66.8,52.85 U$8.P$2
N$26
  Top 0.5: IC10.8 113.2,64.11 113.2,66.8 C7.1
N$28
  Top 0.61: IC7.3 63.03,67.52 DUE_DIGITAL3.8
N$30
  Bottom 0.254: 15.49,69.09 15.75,69.09
N$32
  Top 0.406: SERIAL1.4 94.25,68.7 88.1,68.7 85.5,66.4 85.5,64.7 85.7,64.5 85.7,61.2 85.5,61 IC8.8
N$33  (via drill 0.6)
  Top 0.406: 86.35,65.75 v86.5,65.7 86.5,60.8 85.7,59.7 84.25,59.7 IC8.7
  Bottom 0.406: v86.5,65.7 88.3,69.6 88.3,72.8 90,74.5 94.97,74.5 SERIAL1.3
N$34
  Top 0.406: SERIAL1.2 95.89,67.9 88.4,67.9 87.53,67.03 87.5,66.6 87.5,60.2 86.2,58.5 84.35,58.5 IC8.6
N$35
  Top 0.406: SERIAL1.1 99.7,72.31 99.7,69.4 97.6,67.1 88.8,67.1 88.5,66.81 88.5,59.7 86.2,57.2 84.31,57.2 IC8.5
N$36
  Top 0.406: IC9.8 82.09,77.69 81,76.6 81,71.2 77.7,67.9 76.08,67.9 SERIAL2.4
N$37
  Top 0.406: IC9.7 83.47,79.33 82.8,79.9 81.7,79.9 81.3,79.5 81.3,78.1 77.6,74.4 75.9,74.4 75.2,73.7 75.2,72.9 SERIAL2.3
N$38  (via drill 0.6)
  Top 0.406: v84.5,80.1 84.7,79.55 IC9.6
  Bottom 0.406: SERIAL2.2 78.7,70.2 80.6,72.1 80.6,76.2 v84.5,80.1
N$40  (via drill 0.6)
  Top 0.406: v86,80.6 IC9.5
  Bottom 0.406: SERIAL2.1 77.59,72.99 79.8,75.2 79.8,76.6 83.4,80.2 83.4,80.6 84.1,81.3 85.2,81.3 v86,80.6
N$42
  Top 0.61: IC8.2 77.56,59.73 77,60.5 77,65.22 DUE_DIGITAL3.3
N$43
  Top 0.6: IC2.3 134.8,56.6 139.3,59 139.6,59.2 139.6,64.1 138.27,65.43 U$6.P$20
N$44
  Top 0.6: R7.2 133.67,50.43 U$6.P$17
N$45
  Top 0.6: IC2.2 128.7,55.4 135.4,55.4 136.97,55.43 U$6.P$18
N$46
  Top 1.016: U$5.5VIN 5.4,51.02 L1.1 2.6,50.83 C1.1
N$47
  Top 1.016: L2.2 42.75,52.58 U$5.12VOUT
N$48
  Top 0.61: IC8.3 77.23,58.47 74.9,61.4 74.9,65.76 DUE_DIGITAL3.4
N$52  (via drill 0.6)
  Top 0.61: IC9.2 83.47,71.56 v83.2,71.2
  Route2 0.61: v83.2,71.2 82.9,71.3 80.1,68.5 72.5,68.5 72.5,65.9 DUE_DIGITAL3.5
N$53  (via drill 0.6)
  Top 0.61: IC9.3 84.73,70.83 v84.6,70.8
  Bottom 0.61: v84.6,70.8 84.1,70.3 80.6,67.5 71.36,67.5 DUE_DIGITAL3.6
N$54
  Top 0.6: R2.1 20.2,70.2 16.6,66.8 16.6,65.03 IC1.1
N$55
  Top 0.6: R3.1 10.2,64.6 11.4,66.6 12.6,66.6 12.6,65.03 IC1.4
PGND
  Top 0.6: C1.2 2.6,43.76 U$5.PWR | U$5.12VGND 41.31,40.91 44.6,44.2 C2.2
  Bottom 0.6: IC5.15 IC5.6 IC5.5
  Bottom 1.016: DUE_PWR.4 36.83,28.03 39,30.2 39,38.66 U$5.12VGND | U$5.12VGND U$5.PWR U$5.5VGND | IC5.15 IC5.16 62.53,35.17 61,36.4 55.7,36.4 52.39,39.71 U$5.12VGND
PORT1IN_3V3
  Top 0.4: 74.41,55.21 71,51.8 71,50.9 71.4,50.2 73.78,50.2
  Top 0.406: 74.41,55.21 74.42,55.2 89.5,55.2 89.91,55.61 DUE_DIGITAL4.9
  Top 0.6: 73.78,50.2 IC3.2
PORT1INPUT  (via drill 0.6)
  Top 0.6: PORT1.1 10.79,10.01 9,11.8 9,15.8 v12.4,19.2 | v71.8,48.8 73.7,48.8 IC3.3
  Route2 0.6: v12.4,19.2 13.8,20.6 23.6,20.6 30.6,27.6 39.8,27.6 49.6,37.8 49.6,42.9 53.9,47.2 70.2,47.2 v71.8,48.8 70.6,47.6
PORT1LED  (via drill 0.6)
  Route2 0.4: v27.4,28.7 27.2,57.98 DUE_DIGITAL1.7
  Bottom 0.4: PORT1.3 13.34,8.46 14.6,7.2 18.9,7.2 22.9,11.2 22.9,23.8 v27.4,28.7
PORT2IN_3V3
  Top 0.3: 88.9,56.9 91,56.9
  Top 0.4: DUE_DIGITAL4.11 90.13,53.33 91.4,54.6 91.4,56.4 91,56.9 | 73.9,56 70.1,52.1 70.1,48.7 71.2,47.6 73.77,47.6 IC3.4
  Top 0.406: 73.9,56 88,56 88.9,56.9
PORT2INPUT  (via drill 0.6)
  Top 0.6: v68.9,49 68.9,48.7 70.8,46.4 73.77,46.4 IC3.5
  Route2 0.6: PORT2.1 22,9.4 18.4,6 9,6 6.2,8.6 6.2,14.8 13.4,22 23,22 30,29 39.2,29 48.5,38.4 48.5,45.2 54.9,51.6 65.8,51.6 v68.9,49
PORT2LED  (via drill 0.6)
  Route2 0.4: v42.8,37.4 42.8,38.5 46.2,42.5 46.1,54.83 DUE_DIGITAL1.8
  Bottom 0.4: PORT2.3 29.84,9.15 31.6,7.4 35.4,7.4 38.9,10.9 38.9,11.7 43.6,16.4 43.6,18.6 43.4,22.8 43.2,27.6 43.2,37 v42.8,37.4
PORT3IN_3V3  (via drill 0.6)
  Top 0.4: DUE_DIGITAL4.13 89.13,50.53 v87.6,49 | v72,45.2 73.69,45.2 IC3.6
  Bottom 0.4: v87.6,49 84.4,49 79.2,43.8 73.4,43.8 v72,45.2
PORT3INPUT  (via drill 0.6)
  Top 0.4: v70.5,43.9 70.28,43.83 IC3.7
  Bottom 0.4: PORT3.1 45.71,6.9 54.5,6.9 57.1,11.4 57.1,13.1 59.6,15.6 66.1,15.7 78.8,26.2 78.9,37.7 77.4,40.1 72.5,40.6 70.5,41.9 v70.5,43.9
PORT3LED  (via drill 0.6)
  Route2 0.4: v44.7,36.8 44.6,38.8 47.2,42 47.2,58.8 DUE_DIGITAL2.1
  Bottom 0.4: PORT3.3 46.35,8.74 47.4,7.7 53.6,7.7 55.6,11.1 55.6,12.3 52.3,15.6 46.1,15.6 45.1,16.6 45.1,36 v44.7,36.8
PORT4IN_3V3  (via drill 0.6)
  Top 0.4: DUE_DIGITAL4.15 88.59,47.99 v87.9,47.1 | v81.2,43.8 79.42,43.8 IC3.10
  Bottom 0.4: v87.9,47.1 84.1,47 v81.2,43.8
PORT4INPUT  (via drill 0.6)
  Top 0.4: v81.1,41.7 80.25,42.55 IC3.9
  Bottom 0.4: PORT4.1 62.02,6.8 70.6,6.8 73.1,10.9 73.1,18.9 81.1,26.1 v81.1,41.7
PORT4LED  (via drill 0.6)
  Route2 0.4: v71.6,18.4 71.4,18.5 66.3,23.8 66.3,45.1 v66.1,45.3
  Bottom 0.4: PORT4.3 62.87,8.44 63.8,7.6 69.8,7.6 71.6,10.2 v71.6,18.4 | DUE_DIGITAL2.2 46.2,63.04 46.2,60 51.1,55.9 62.4,55.9 63,55.4 63,47.8 64.8,46.3 v66.1,45.3
PORT5IN_3V3
  Top 0.3: 91,41.6 89.2,41.6
  Top 0.4: DUE_DIGITAL4.17 90.13,45.07 91.4,43.8 91.4,42 91,41.6 | 86.8,41.7 82,46.4 79.44,46.4 IC3.12
  Top 0.406: 89.2,41.6 86.8,41.7
PORT5INPUT  (via drill 0.6)
  Top 0.4: v82.9,43.4 81.91,45.09 IC3.11
  Bottom 0.4: PORT5.1 78.33,7.9 86.4,7.9 87.3,8.8 87.3,19.4 82.9,23.8 v82.9,43.4
PORT5LED  (via drill 0.6)
  Top 0.4: v88.4,18.3 73.8,18.3 69.1,23 52.4,23 47.6,27.6 v47.6,62.2
  Route2 0.4: PORT5.3 79.38,8.22 80.7,6.9 86.8,6.9 89.6,9.6 v89.6,13.1
  Bottom 0.4: v89.6,13.1 89.5,17.2 v88.4,18.3 | v47.6,62.2 47.8,63.68 DUE_DIGITAL2.3
PORT6IN_3V3
  Top 0.4: IC3.15 82.86,50.17 DUE_DIGITAL4.19
PORT6INPUT  (via drill 0.6)
  Top 0.4: v84.4,45.4 80.89,48.91 IC3.14
  Bottom 0.4: PORT6.1 95.04,7.7 103.9,7.7 104.2,8 104.2,15.7 95.9,24 84.4,24 v84.4,45.4
PORT6LED  (via drill 0.6)
  Route2 0.4: PORT6.3 95.89,8.41 97.2,7.1 103.9,7.1 106.1,9.3 v106.1,13.1 | v85.5,41.3 85.5,44.1 86,44.8 86,50.7 82.3,54.5 68,54.5 66.1,56.5 58.82,56.5 DUE_DIGITAL2.4
  Bottom 0.4: v106.1,13.1 106.1,15.4 96.3,25.2 87,25.2 85.5,26.7 v85.5,41.3
PORT7IN_3V3  (via drill 0.6)
  Top 0.6: v99,27.1 v99,27.09 IC4.6
  Route2 0.6: v99,27.1 95.4,27.1 87.8,35.3 87.8,40.37 DUE_DIGITAL4.21
PORT7INPUT  (via drill 0.6)
  Top 0.6: v107.2,20.8 105.2,22.8 99.7,22.8 98.3,23.9 98.3,24.9 99.2,25.8 101.17,25.8 IC4.7
  Bottom 0.6: PORT7.1 109.86,9.85 108.1,11.6 108.1,19.9 v107.2,20.8
PORT7LED  (via drill 0.6)
  Route2 0.4: PORT7.3 112.39,8.51 113.4,7.5 121,7.5 122.7,9.2 v122.7,13.1
  Route15 0.4: v87.2,43.8 87.2,44.4 v78.5,53.1
  Bottom 0.4: v122.7,13.1 122.7,14.2 114.9,22.2 100.8,22.2 96.9,26.3 87.6,26.3 86.8,27.1 86.8,43.2 v87.2,43.8 | v78.5,53.1 74.2,57.4 60.46,57.4 DUE_DIGITAL2.5
PORT8IN_3V3  (via drill 0.6)
  Top 0.6: v109.1,25.8 106.83,25.8 IC4.10
  Bottom 0.6: v109.1,25.8 109.7,26.4 109.7,33.4 106.9,36.2 91.5,36.2 DUE_DIGITAL4.23
PORT8INPUT  (via drill 0.6)
  Top 0.6: v108.3,24.5 108.25,24.55 IC4.9
  Bottom 0.6: v108.3,24.5 114.8,24.5 125.7,13.6 125.7,10.32 PORT8.1
PORT8LED  (via drill 0.6)
  Top 0.406: 77.8,34.3 69.3,42.8 69.3,46.5 67.6,48.3 67.6,50.4 70.7,54.1 70.7,57.2 66.4,61.5 63.2,61.5 v62.9,61.8
  Top 0.61: PORT8.3 129.16,8.84 131.2,6.8 136,6.8 139.1,11 139.1,13.3 135.1,18.4 92.1,18.4 77.8,32.7 77.8,34.3
  Bottom 0.406: v62.9,61.8 57.8,61.8 54.6,65 54.6,65.78 DUE_DIGITAL2.6
RCK  (via drill 0.6)
  Route2 0.4: IC5.7 68.8,27.2 68.8,36.1 83.4,51 v83.6,51.2
  Route15 0.4: v83.6,51.2 86.9,60 DUE_DIGITAL4.3
SPI_CLK
  Bottom 0.6: ICSP.3 59.03,42.93 57.3,42.9 57.3,39.6 58.8,38.5 74,38.5 76.7,35 76.7,32.1 74.2,29.4 72,29.4 70.2,27.2 70.2,25.96 IC5.8
UPPER_5V
  Top 0.5: C6.1
  Top 0.6: IC10.1 105.7,64.1 105.7,66.4 C6.1
  Top 0.8: DUE_DIGITAL4.2 97.53,65.77 98.8,64.5 103.9,64.5 C6.1
VCC  (via drill 0.6)
  Top 0.6: 100.36,33.45 98.7,35.1 v98.7,54 99.11,53.99 119.7,53.99 C9.2 120.59,54.09 IC2.8 | 16.6,59.37 18.88,59.37 C8.1 v20.8,59.5
  Top 0.61: 16.6,59.37 IC1.8 | IC4.1 100.36,33.45 | C3.1 79.4,63.3 78.8,62.7 78.8,61.59 IC8.1 78.8,61.41 78.8,63.3 v78.3,63.8 | C5.1 60.9,63.2 60.9,64.3 61.3,64.8 61.3,66.4 60.5,67.3 IC7.1 | v72.3,51.4 73.64,51.4 IC3.1 | v84.4,64.9 84.3,65 84.3,66.7 83.9,67.4 82.9,67.4 82.4,67.9 C4.1 82.09,68.91 82.09,70.61 82,70.7 82,71.8 82.2,72 IC9.1 | v98.7,54 98.7,52.68
  Top 0.8: v50.8,34.7 50.8,51.7 | 50.8,51.7 v48.6,51.7 | 50.8,51.7 50.8,56.8 58.6,56.8 | C5.1 58.6,63 58.6,56.8 | 58.6,56.8 63.9,56.8 | 63.9,56.8 v63.9,58.5 | v68.5,53.4 68.5,53.7 65.4,56.8 63.9,56.8
  Route2 0.8: DUE_PWR.2 31.75,18.55 37.5,24.3 40.4,24.3 v50.8,34.7
  Bottom 0.406: 93.5,64.5 89.1,64.5
  Bottom 0.6: 20.8,56.8 v20.8,59.5
  Bottom 0.61: v48.6,51.7 46.7,51.7 41.6,56.8 20.8,56.8 | v68.5,53.4 70.2,53.4 v72.3,51.4 | v63.9,58.5 69.2,63.8 v78.3,63.8 79,63.7 84.3,63.7 | 84.3,63.7 85.2,63.7 85.7,63.2 87.7,63.2 89,64.5 89.1,64.5 | v84.4,64.9 84.4,63.8 84.3,63.7 | 93.5,64.5 98.7,64.5 v98.7,54
WIRE_INPUT1
  Top 0.6: DUE_DIGITAL4.12 95.07,53.07 96.5,55.4 122.33,55.4 IC2.7
  Bottom 0.6: DUE_DIGITAL4.12 92.67,52.93
WIRE_INPUT2
  Top 0.6: 122.23,56.5 IC2.6 93.69,56.63 DUE_DIGITAL4.10
WIRE_OUT1
  Bottom 0.6: DUE_DIGITAL4.24 92.7,37.8 121.6,37.8 137.16,22.24 U$6.P$11
WIRE_OUT2
  Bottom 0.6: DUE_DIGITAL4.22 92.74,40.3 126.2,40.3 136.07,30.43 U$6.P$13
WIREOUT3
  Bottom 0.6: DUE_DIGITAL4.20 92.78,42.8 134.5,42.8 136.87,40.43 U$6.P$15

### Text on the board
tPlace: Output Ch2 | Output Ch1 | Input Ch2 | Input Ch1 | RS485 | Driver | RS485 | Driver | BNC4 | BNC3 | BNC2 | BNC1 | Serial 3 | Serial 2 | Serial 1 | ACPL | 064L | . | ADUM | 5240 | LED1 | RS485 | Driver | ACPL | 064L | TPIC6A595NE | Spring terminal | Bpod r1.0 | Open source animal behavior measurement & stimulus control | Sanworks.io | Port 1 | Port 8